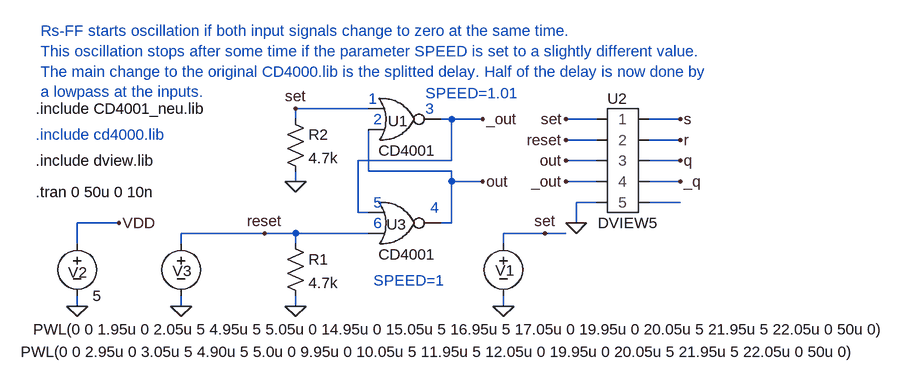
[diagram p0: schematic nor_gate_latch.asc]
nor_gate_latch.asc, the LTspice schematic file:
Version 4
SHEET 1 1772 1044
WIRE 16 112 -96 112
WIRE -96 128 -96 112
WIRE 144 128 128 128
WIRE 192 128 144 128
WIRE 368 128 320 128
WIRE 496 128 448 128
WIRE 368 160 320 160
WIRE 496 160 448 160
WIRE 144 192 144 128
WIRE 144 192 0 192
WIRE 368 192 320 192
WIRE 496 192 448 192
WIRE 16 208 16 144
WIRE 144 208 16 208
WIRE -96 224 -96 208
WIRE 144 224 144 208
WIRE 192 224 144 224
WIRE 368 224 320 224
WIRE 496 224 448 224
WIRE 368 256 336 256
WIRE 496 256 448 256
WIRE 0 272 0 192
WIRE 16 272 0 272
WIRE -368 288 -432 288
WIRE 144 288 144 224
WIRE 144 288 128 288
WIRE 336 288 336 256
WIRE -144 304 -272 304
WIRE -96 304 -144 304
WIRE 16 304 -96 304
WIRE 288 304 224 304
WIRE 320 304 288 304
WIRE -432 320 -432 288
WIRE -272 320 -272 304
WIRE -96 320 -96 304
WIRE 224 320 224 304
WIRE -432 416 -432 400
WIRE -272 416 -272 400
WIRE -96 416 -96 400
WIRE 224 416 224 400
FLAG -96 224 0
FLAG -96 416 0
FLAG 224 416 0
FLAG -432 416 0
FLAG -368 288 VDD
FLAG -272 416 0
FLAG 192 224 out
FLAG 320 128 set
FLAG 320 160 reset
FLAG 320 192 out
FLAG 320 224 _out
FLAG 192 128 _out
FLAG 496 128 s
FLAG 496 160 r
FLAG 496 192 q
FLAG 496 224 _q
FLAG -96 112 set
FLAG -144 304 reset
FLAG 336 288 0
FLAG 288 304 set
SYMBOL res -112 304 R0
SYMATTR InstName R1
SYMATTR Value 4.7k
SYMBOL res -112 112 R0
SYMATTR InstName R2
SYMATTR Value 4.7k
SYMBOL voltage 224 304 R0
WINDOW 3 -743 182 Left 0
WINDOW 123 0 0 Left 0
WINDOW 39 0 0 Left 0
WINDOW 0 -12 57 Left 0
SYMATTR Value PWL(0 0 2.95u 0 3.05u 5 4.90u 5 5.0u 0 9.95u 0 10.05u 5 11.95u 5 12.05u 0 19.95u 0 20.05u 5 21.95u 5 22.05u 0 50u 0)
SYMATTR InstName V1
SYMBOL voltage -432 304 R0
WINDOW 0 -14 60 Left 0
SYMATTR InstName V2
SYMATTR Value 5
SYMBOL voltage -272 304 R0
WINDOW 3 -228 148 Left 0
WINDOW 123 0 0 Left 0
WINDOW 39 0 0 Left 0
WINDOW 0 -13 58 Left 0
SYMATTR Value PWL(0 0 1.95u 0 2.05u 5 4.95u 5 5.05u 0 14.95u 0 15.05u 5 16.95u 5 17.05u 0 19.95u 0 20.05u 5 21.95u 5 22.05u 0 50u 0)
SYMATTR InstName V3
SYMBOL dview5 384 272 R0
SYMATTR InstName U2
SYMBOL CD4001B 64 64 R0
WINDOW 0 -18 67 Left 0
SYMATTR InstName U1
SYMATTR SpiceLine VDD=5  SPEED=1.01  TRIPDT=5e-9
SYMATTR Value CD4001
SYMBOL CD4001B 64 224 R0
WINDOW 0 -20 66 Left 0
SYMATTR InstName U3
SYMATTR Value CD4001
TEXT -496 240 Left 0 !.tran 0 50u 0 10n
TEXT -496 152 Left 0 ;.include cd4000.lib
TEXT -496 192 Left 0 !.include dview.lib
TEXT 16 96 Left 0 ;1
TEXT 24 128 Left 0 ;2
TEXT 104 112 Left 0 ;3
TEXT 112 264 Left 0 ;4
TEXT 24 256 Left 0 ;5
TEXT 24 288 Left 0 ;6
TEXT 104 88 Left 0 ;SPEED=1.01
TEXT 24 376 Left 0 ;SPEED=1
TEXT -496 112 Left 0 !.include CD4001_neu.lib
TEXT -488 -8 Left 0 ;Rs-FF starts oscillation if both input signals change to zero at the same time.\nThis oscillation stops after some time if the parameter SPEED is set to a slightly different value.\nThe main change to the original CD4000.lib is the splitted delay. Half of the delay is now done by \na lowpass at the inputs.

The netlist it stands for:
* nor_gate_latch.asc
R1 reset 0 4.7k
R2 set 0 4.7k
V1 set 0 PWL(0 0 2.95u 0 3.05u 5 4.90u 5 5.0u 0 9.95u 0 10.05u 5 11.95u 5 12.05u 0 19.95u 0 20.05u 5 21.95u 5 22.05u 0 50u 0)
V2 VDD 0 5
V3 reset 0 PWL(0 0 1.95u 0 2.05u 5 4.95u 5 5.05u 0 14.95u 0 15.05u 5 16.95u 5 17.05u 0 19.95u 0 20.05u 5 21.95u 5 22.05u 0 50u 0)
XU2 set s reset r out q _out _q 0 N001 DVIEW5 OFFSET=0  GAIN=0.1  ; pins i1 o1 i2 o2 i3 o3 i4 o4 i5 o5
XU1 set out _out VDD 0 CD4001 VDD=5  SPEED=1.01  TRIPDT=5e-9  ; pins A B Y
XU3 _out reset out VDD 0 CD4001 VDD=5  SPEED=1.0  TRIPDT=5e-9  ; pins A B Y
.tran 0 50u 0 10n
* .include cd4000.lib
.include dview.lib
* 1
* 2
* 3
* 4
* 5
* 6
* SPEED=1.01
* SPEED=1
.include CD4001_neu.lib
* Rs-FF starts oscillation if both input signals change to zero at the same time.
* This oscillation stops after some time if the parameter SPEED is set to a slightly different value.
* The main change to the original CD4000.lib is the splitted delay. Half of the delay is now done by
* a lowpass at the inputs.
.backanno
.end